# EAGLE schematic Cansat2019_1516_PayloadB_v6 (EAGLE 7.3.0)
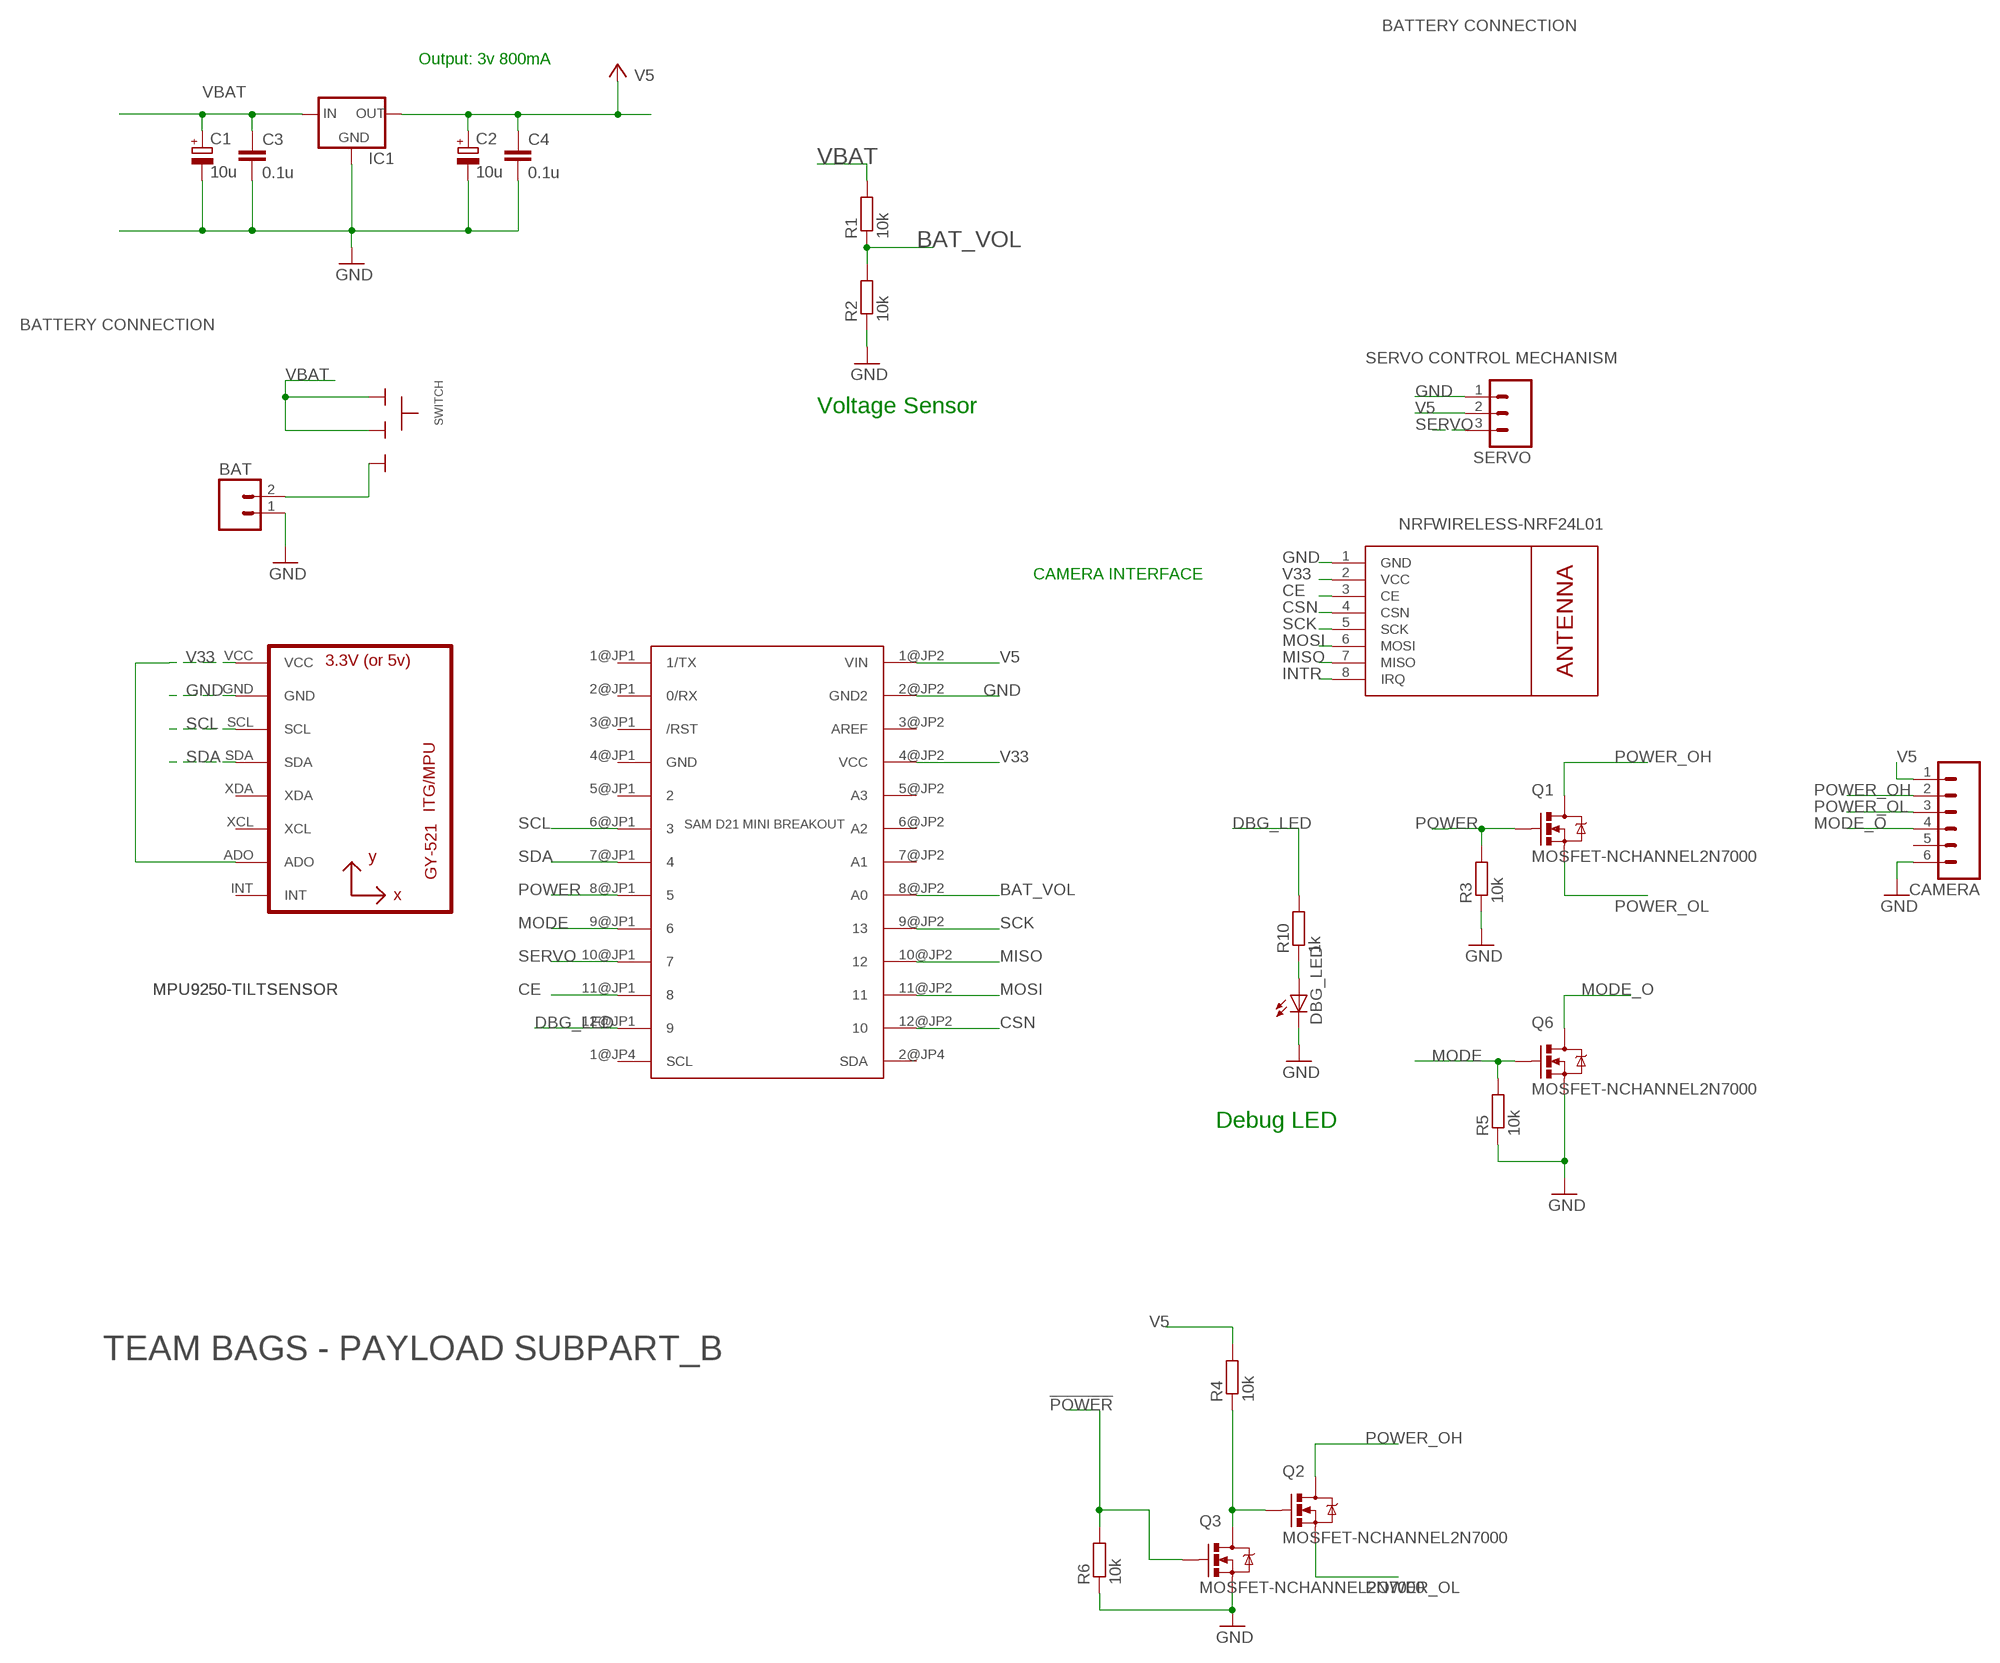
[diagram p0: schematic, sheet 1]

## Parts
BAT  M02  [02P]
C1  10u  CPOL-EUE2-4  [E2-4]
C2  10u  CPOL-EUE2-4  [E2-4]
C3  0.1u  C-EU025-025X050  [C025-025X050]
C4  0.1u  C-EU025-025X050  [C025-025X050]
CAMERA  M06  [06P]
DBG_LED  LED3MM  [LED3MM]
IC1  V_REG_78XX-TO-220  [TO-220-ALT]
MPU  GY-521MPU6050  [GY-521]
NRF  WIRELESS-NRF24L01  [WIRELESS-NRF24L01]
Q1  MOSFET-NCHANNEL2N7000  [TO-92]
Q2  MOSFET-NCHANNEL2N7000  [TO-92]
Q3  MOSFET-NCHANNEL2N7000  [TO-92]
Q6  MOSFET-NCHANNEL2N7000  [TO-92]
R1  10k  R-EU_0204/7  [0204/7]
R2  10k  R-EU_0204/7  [0204/7]
R3  10k  R-EU_0204/7  [0204/7]
R4  10k  R-EU_0204/7  [0204/7]
R5  10k  R-EU_0204/7  [0204/7]
R6  10k  R-EU_0204/7  [0204/7]
R10  1k  R-EU_0204/7  [0204/7]
SERVO  M03  [03P]
SWITCH  SLIDESWITCH-BIG  [BIGSWITCH]
U$2  SAM_D21_MINI_BREAKOUT  [JP1_SPARKFUN-SAMD21-MINI-BREAKOUT-V10]

## Nets
!POWER: Q3.2(G) R6.2
BAT_VOL: R1.1 R2.2 U$2.8@JP2(A0)
CE: NRF.3(CE) U$2.11@JP1
CSN: NRF.4(CSN) U$2.12@JP2
DBG_LED: R10.2 U$2.12@JP1
GND [power]: BAT.1 C1.- C2.- C3.2 C4.2 CAMERA.6 DBG_LED.K(C) IC1.GND MPU.GND NRF.1(GND) Q3.1(S) Q6.1(S) R2.1 R3.1 R5.1 R6.1 SERVO.1 U$2.2@JP2(GND2)
INTR: NRF.8(IRQ)
MISO: NRF.7(MISO) U$2.10@JP2
MODE [power]: Q6.2(G) R5.2 U$2.9@JP1
MODE_O: CAMERA.4 Q6.3(D)
MOSI: NRF.6(MOSI) U$2.11@JP2
N$1 [power_main]: BAT.2 SWITCH.3
N$5: Q2.2(G) Q3.3(D) R4.1
N$15: DBG_LED.A R10.1
POWER: Q1.2(G) R3.2 U$2.8@JP1
POWER_OH: CAMERA.2 Q1.3(D) Q2.3(D)
POWER_OL: CAMERA.3 Q1.1(S) Q2.1(S)
SCK: NRF.5(SCK) U$2.9@JP2
SCL: MPU.SCL U$2.6@JP1
SDA: MPU.SDA U$2.7@JP1
SERVO: SERVO.3 U$2.10@JP1
V5 [power]: C2.+ C4.1 CAMERA.1 IC1.OUT R4.2 SERVO.2 U$2.1@JP2(VIN) ; supply symbol labelled VCC
V33 [power]: MPU.ADO MPU.VCC NRF.2(VCC) U$2.4@JP2(VCC)
VBAT [power_main]: C1.+ C3.1 IC1.IN R1.2 SWITCH.1 SWITCH.2
Unconnected: CAMERA.5 MPU.INT MPU.XCL MPU.XDA U$2.1@JP1(1/TX) U$2.1@JP4(SCL) U$2.2@JP1(0/RX) U$2.2@JP4(SDA) U$2.3@JP1(/RST) U$2.5@JP1 U$2.5@JP2(A3) U$2.6@JP2(A2) U$2.7@JP2(A1)

## Notes on the sheet
- BATTERY CONNECTION
- Output: 3v 800mA
- BATTERY CONNECTION
- SERVO CONTROL MECHANISM
- Voltage Sensor
- CAMERA INTERFACE
- MPU9250-TILTSENSOR | MPU9250-TILTSENSOR
- Debug LED
- TEAM BAGS - PAYLOAD SUBPART_B

## Power pins joined to a net without a drawn wire
AREF: U$2.3@JP2(AREF)
GND: U$2.4@JP1(GND)

## Library data of the parts
BAT = CEDT_JANUARY_2015_v5:M02: AMP QUICK CONNECTOR
C1 C2 = rcl:CPOL-EU: POLARIZED CAPACITOR, European symbol
C3 C4 = rcl:C-EU: CAPACITOR, European symbol
CAMERA = con-amp-quick:M06: AMP QUICK CONNECTOR; OC_FARNELL: unknown; OC_NEWARK: unknown
DBG_LED = 01_adafruit:LED: LED OSRAM: - CHIPLED LG R971, LG N971, LY N971, LG Q971, LY Q971, LO R971, LY R971 LH N974, LH R974 LS Q976, LO Q976, LY Q976 LO Q996 - Hyper CHIPLED LW Q18S LB Q993, LB Q99A, LB R99A - SideLED LS A670, LO A670, LY A670, LG A670, LP A670 LB A673, LV A673, LT A673, LW A673 LH A674 LY A675 LS A676, LA A676, LO A676, LY A676, LW A676 LS A679, LY A679, LG A679 - Hyper Micro SIDELED® LS Y876, LA Y876, LO Y876, LY Y876 LT Y87S - SmartLED LW L88C, LW L88S LB L89C, LB L89S, LG L890 LS L89K, LO L89K, LY L89K LS L896, LA L896, LO L896, LY L896 - TOPLED LS T670, LO T670, LY T670, LG T670, LP T670 LSG T670, LSP T670, LSY T670, LOP T670, LYG T670 LG T671, LOG T671, LSG T671 LB T673, LV T673, LT T673, LW T673 LH T674 LS T676, LA T676, LO T676, LY T676, LB T676, LH T676, LSB T676, LW T676 LB T67C, LV T67C, LT T67C, LS T67K, LO T67K, LY T67K, LW E67C LS E67B, LA E67B, LO E67B, LY E67B, LB E67C, LV E67C, LT E67C LW T67C LS T679, LY T679, LG T679 LS T770, LO T770, LY T770, LG T770, LP T770 LB T773, LV T773, LT T773, LW T773 LH T774 LS E675, LA E675, LY E675, LS T675 LS T776, LA T776, LO T776, LY T776, LB T776 LHGB T686 LT T68C, LB T68C - Hyper Mini TOPLED® LB M676 - Mini TOPLED Santana® LG M470 LS M47K, LO M47K, LY M47K Source: http://www.osram.convergy.de/
IC1 = SparkFun-PowerIC:V_REG_78XX: Voltage Regulator Standard 7805 5V regulator. IGO (Input Ground Output). Spark Fun Electronics SKU : COM-00107
MPU = gy-521:GY-521
NRF = diy-modules:WIRELESS-NRF24L01: 2.4 GHz Wireless Module based on NRF24L01 chip More details available here: http://www.electrodragon.com/w/NRF24L01 Click here to find device on ebay.com <http://www.ebay.com/sch/nrf24l01+arduino>
Q1-Q3 Q6 = SparkFun-DiscreteSemi:MOSFET-NCHANNEL: Common NMOSFET Parts MFG P/N Store ID Prod ID FDD8780 TRANS-09984 SI7820DN TRANS-11055 FDS6630A IC-08089 2N7002PW TRANS-11151 FQP30N06L COM-10213 TRANS-10060 BSS123LT1G TRANS-08345 BSS138 TRANS-00830 BS170 2N7000
R1-R6 R10 = rcl:R-EU_: RESISTOR, European symbol
SERVO = con-amp-quick:M03: AMP QUICK CONNECTOR; OC_FARNELL: unknown; OC_NEWARK: unknown
SWITCH = CEDT_JANUARY_2015_v5:SLIDESWITCH
U$2 = SparkFun-SAMD21-Mini-Breakout:SAM_D21_MINI_BREAKOUT: SPARKFUN-SAMD21-MINI-BREAKOUT

## Net classes
0 default: width 0.305 mm
1 power: width 0.61 mm, clearance 0.305 mm
2 power_main: width 0.813 mm, clearance 0.356 mm